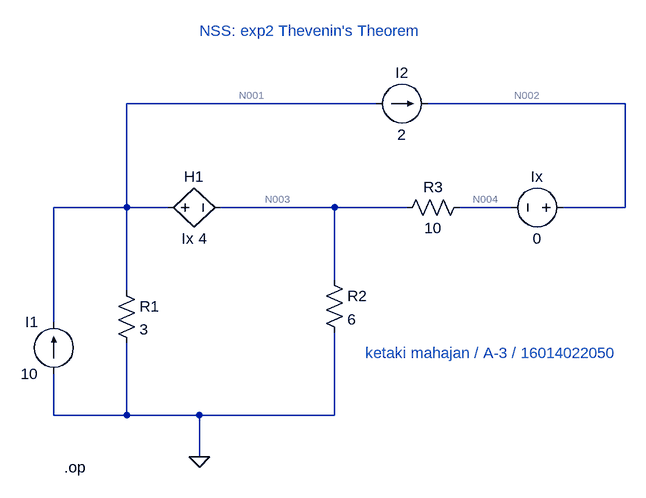
[diagram p0: schematic exp2_thev_16014022050.asc]
exp2_thev_16014022050.asc, the LTspice schematic file:
Version 4
SHEET 1 888 680
WIRE 464 -96 80 -96
WIRE 848 -96 544 -96
WIRE 80 64 80 -96
WIRE 80 64 -32 64
WIRE 144 64 80 64
WIRE 400 64 224 64
WIRE 512 64 400 64
WIRE 672 64 592 64
WIRE 848 64 848 -96
WIRE 848 64 752 64
WIRE 400 176 400 64
WIRE 80 192 80 64
WIRE -32 240 -32 64
WIRE -32 384 -32 320
WIRE 80 384 80 272
WIRE 80 384 -32 384
WIRE 192 384 80 384
WIRE 400 384 400 256
WIRE 400 384 192 384
WIRE 192 448 192 384
FLAG 192 448 0
SYMBOL res 384 160 R0
SYMATTR InstName R2
SYMATTR Value 6
SYMBOL res 608 48 R90
WINDOW 0 0 56 VBottom 2
WINDOW 3 32 56 VTop 2
SYMATTR InstName R3
SYMATTR Value 10
SYMBOL voltage 768 64 R90
WINDOW 0 -32 56 VBottom 2
WINDOW 3 32 56 VTop 2
SYMATTR InstName Ix
SYMATTR Value 0
SYMBOL h 128 64 R270
WINDOW 0 32 56 VTop 2
WINDOW 3 -32 56 VBottom 2
SYMATTR InstName H1
SYMATTR Value Ix 4
SYMBOL current 464 -96 R270
WINDOW 0 32 40 VTop 2
WINDOW 3 -32 40 VBottom 2
SYMATTR InstName I2
SYMATTR Value 2
SYMBOL res 64 176 R0
SYMATTR InstName R1
SYMATTR Value 3
SYMBOL current -32 320 R180
WINDOW 0 24 80 Left 2
WINDOW 3 24 0 Left 2
WINDOW 123 0 0 Left 0
WINDOW 39 0 0 Left 0
SYMATTR InstName I1
SYMATTR Value 10
TEXT -16 464 Left 2 !.op
TEXT 448 288 Left 2 ;ketaki mahajan / A-3 / 16014022050
TEXT 192 -208 Left 2 ;NSS: exp2 Thevenin's Theorem

The netlist it stands for:
* exp2_thev_16014022050.asc
R2 N003 0 6
R3 N004 N003 10
V§Ix N002 N004 0
H1 N001 N003 Ix 4
I2 N001 N002 2
R1 N001 0 3
I1 0 N001 10
.op
* ketaki mahajan / A-3 / 16014022050
* NSS: exp2 Thevenin's Theorem
.backanno
.end

* Results of the author's LTspice run, read from the files saved beside the schematic
* Operating Point:
*   V(n003) = 14.67 V
*   V(n004) = 34.67 V
*   V(n002) = 34.67 V
*   V(n001) = 22.67 V
*   I(H1) = 444.4 mA
*   I(I2) = 2 A
*   I(I1) = 10 A
*   I(R2) = 2.444 A
*   I(R3) = 2 A
*   I(R1) = 7.556 A
*   I(Ix) = 2 A